# EAGLE design Equemático (EAGLE 9.6.2)
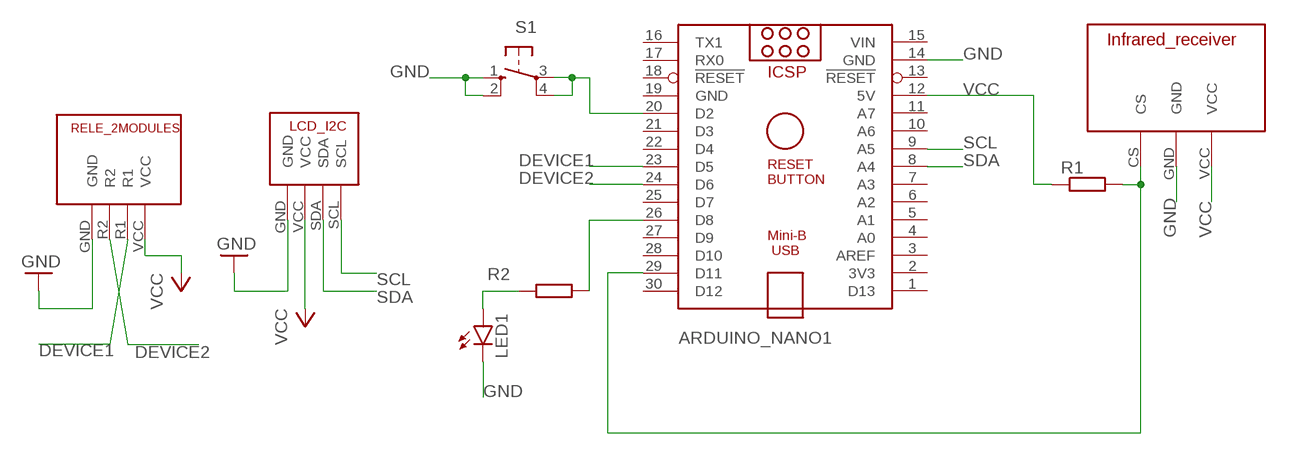
[diagram p0: schematic, sheet 1]

## Parts
ARDUINO_NANO1  ARDUINO_NANO  [ARDUINO_NANO]
LED1  LED5MM  [LED5MM]
R1  R-EU_0207/10  [0207/10]
R2  R-EU_0207/10  [0207/10]
S1  10-XX  [B3F-10XX]
U$1  INFRARED_RECEIVER  [INFRARED_RECEIVER_FOOTPRINT]
U$6  RELE_2MODULES  [RELE_2MODULES_FOOTPRINT]
U$10  LCD_I2C  [LCD_I2C_FOOTPRINT]

## Nets
DEVICE1: ARDUINO_NANO1.23(D5) U$6.R1
DEVICE2: ARDUINO_NANO1.24(D6) U$6.R2
GND: ARDUINO_NANO1.14(GND) LED1.K(C) S1.1(S) S1.2(S1) U$1.GND U$6.GND U$10.GND
N$3: ARDUINO_NANO1.26(D8) R2.2
N$4: LED1.A R2.1
N$5: ARDUINO_NANO1.29(D11) R1.2 U$1.CS
N$6: ARDUINO_NANO1.20(D2) S1.3(P) S1.4(P1)
SCL: ARDUINO_NANO1.9(A5) U$10.SCL
SDA: ARDUINO_NANO1.8(A4) U$10.SDA
VCC: ARDUINO_NANO1.12(5V) R1.1 U$1.VCC U$6.VCC U$10.VCC
Unconnected: ARDUINO_NANO1.1(D13) ARDUINO_NANO1.2(3V3) ARDUINO_NANO1.3(AREF) ARDUINO_NANO1.4(A0) ARDUINO_NANO1.5(A1) ARDUINO_NANO1.6(A2) ARDUINO_NANO1.7(A3) ARDUINO_NANO1.10(A6) ARDUINO_NANO1.11(A7) ARDUINO_NANO1.13(!RESET) ARDUINO_NANO1.16(TX1) ARDUINO_NANO1.17(RX0) ARDUINO_NANO1.18(!RESET) ARDUINO_NANO1.21(D3) ARDUINO_NANO1.22(D4) ARDUINO_NANO1.25(D7) ARDUINO_NANO1.27(D9) ARDUINO_NANO1.28(D10) ARDUINO_NANO1.30(D12)

## Power pins joined to a net without a drawn wire
GND: ARDUINO_NANO1.19(GND)
VIN: ARDUINO_NANO1.15(VIN)

## Library data of the parts
ARDUINO_NANO1 = ArduinoNanoV30:ARDUINO_NANO: Arduino Nano V3.0 Overview: The Arduino Nano is a small, complete, and breadboard-friendly board based on the ATmega328 (Arduino Nano 3.x) or ATmega168 (Arduino Nano 2.x). It has more or less the same functionality of the Arduino Duemilanove, but in a different package. It lacks only a DC power jack, and works with a Mini-B USB cable instead of a standard one. The Nano was designed and is being produced by Gravitech. Specifications: Microcontroller Atmel ATmega168 or ATmega328 Operating Voltage (logic level) 5 V Input Voltage (recommended) 7-12 V Input Voltage (limits) 6-20 V Digital I/O Pins 14 (of which 6 provide PWM output) Analog Input Pins 8 DC Current per I/O Pin 40 mA Flash Memory 16 KB (ATmega168) or 32 KB (ATmega328) of which 2 KB used by bootloader SRAM 1 KB (ATmega168) or 2 KB (ATmega328) EEPROM 512 bytes (ATmega168) or 1 KB (ATmega328) Clock Speed 16 MHz Dimensions 0.73" x 1.70" Length 45 mm Width 18 mm Weigth 5 g Power: The Arduino Nano can be powered via the Mini-B USB connection, 6-20V unregulated external power supply (pin 30), or 5V regulated external power supply (pin 27). The power source is automatically selected to the highest voltage source. Memory: The ATmega168 has 16 KB of flash memory for storing code (of which 2 KB is used for the bootloader); the ATmega328 has 32 KB, (also with 2 KB used for the bootloader). The ATmega168 has 1 KB of SRAM and 512 bytes of EEPROM (which can be read and written with the EEPROM library); the ATmega328 has 2 KB of SRAM and 1 KB of EEPROM. Input and Output: Each of the 14 digital pins on the Nano can be used as an input or output, using pinMode(), digitalWrite(), and digitalRead() functions. They operate at 5 volts. Each pin can provide or receive a maximum of 40 mA and has an internal pull-up resistor (disconnected by default) of 20-50 kOhms. In addition, some pins have specialized functions. Visit Arduino - ArduinoBoardNano <https://www.arduino.cc/en/Main/ArduinoBoardNano>
LED1 = led:LED: LED OSRAM: - CHIPLED LG R971, LG N971, LY N971, LG Q971, LY Q971, LO R971, LY R971 LH N974, LH R974 LS Q976, LO Q976, LY Q976 LO Q996 - Hyper CHIPLED LW Q18S LB Q993, LB Q99A, LB R99A - SideLED LS A670, LO A670, LY A670, LG A670, LP A670 LB A673, LV A673, LT A673, LW A673 LH A674 LY A675 LS A676, LA A676, LO A676, LY A676, LW A676 LS A679, LY A679, LG A679 - Hyper Micro SIDELED® LS Y876, LA Y876, LO Y876, LY Y876 LT Y87S - SmartLED LW L88C, LW L88S LB L89C, LB L89S, LG L890 LS L89K, LO L89K, LY L89K LS L896, LA L896, LO L896, LY L896 - TOPLED LS T670, LO T670, LY T670, LG T670, LP T670 LSG T670, LSP T670, LSY T670, LOP T670, LYG T670 LG T671, LOG T671, LSG T671 LB T673, LV T673, LT T673, LW T673 LH T674 LS T676, LA T676, LO T676, LY T676, LB T676, LH T676, LSB T676, LW T676 LB T67C, LV T67C, LT T67C, LS T67K, LO T67K, LY T67K, LW E67C LS E67B, LA E67B, LO E67B, LY E67B, LB E67C, LV E67C, LT E67C LW T67C LS T679, LY T679, LG T679 LS T770, LO T770, LY T770, LG T770, LP T770 LB T773, LV T773, LT T773, LW T773 LH T774 LS E675, LA E675, LY E675, LS T675 LS T776, LA T776, LO T776, LY T776, LB T776 LHGB T686 LT T68C, LB T68C - Hyper Mini TOPLED® LB M676 - Mini TOPLED Santana® LG M470 LS M47K, LO M47K, LY M47K Source: http://www.osram.convergy.de LUXEON: - LUMILED® LXK2-PW12-R00, LXK2-PW12-S00, LXK2-PW14-U00, LXK2-PW14-V00 LXK2-PM12-R00, LXK2-PM12-S00, LXK2-PM14-U00 LXK2-PE12-Q00, LXK2-PE12-R00, LXK2-PE12-S00, LXK2-PE14-T00, LXK2-PE14-U00 LXK2-PB12-K00, LXK2-PB12-L00, LXK2-PB12-M00, LXK2-PB14-N00, LXK2-PB14-P00, LXK2-PB14-Q00 LXK2-PR12-L00, LXK2-PR12-M00, LXK2-PR14-Q00, LXK2-PR14-R00 LXK2-PD12-Q00, LXK2-PD12-R00, LXK2-PD12-S00 LXK2-PH12-R00, LXK2-PH12-S00 LXK2-PL12-P00, LXK2-PL12-Q00, LXK2-PL12-R00 Source: www.luxeon.com KINGBRIGHT: KA-3528ASYC Source: www.kingbright.com
R1 R2 = rcl:R-EU_: RESISTOR, European symbol; SPICEPREFIX: R
S1 = switch-omron:10-XX: OMRON SWITCH; MPN: B3F-1000; OC_FARNELL: 176432; OC_NEWARK: 36M3542
U$1 = Meus componentes:INFRARED_RECEIVER
U$6 = Meus componentes:RELE_2MODULES
U$10 = Meus componentes:LCD_I2C

## Module LCD_I2C
Ports: 

### Library data of the parts

## Board
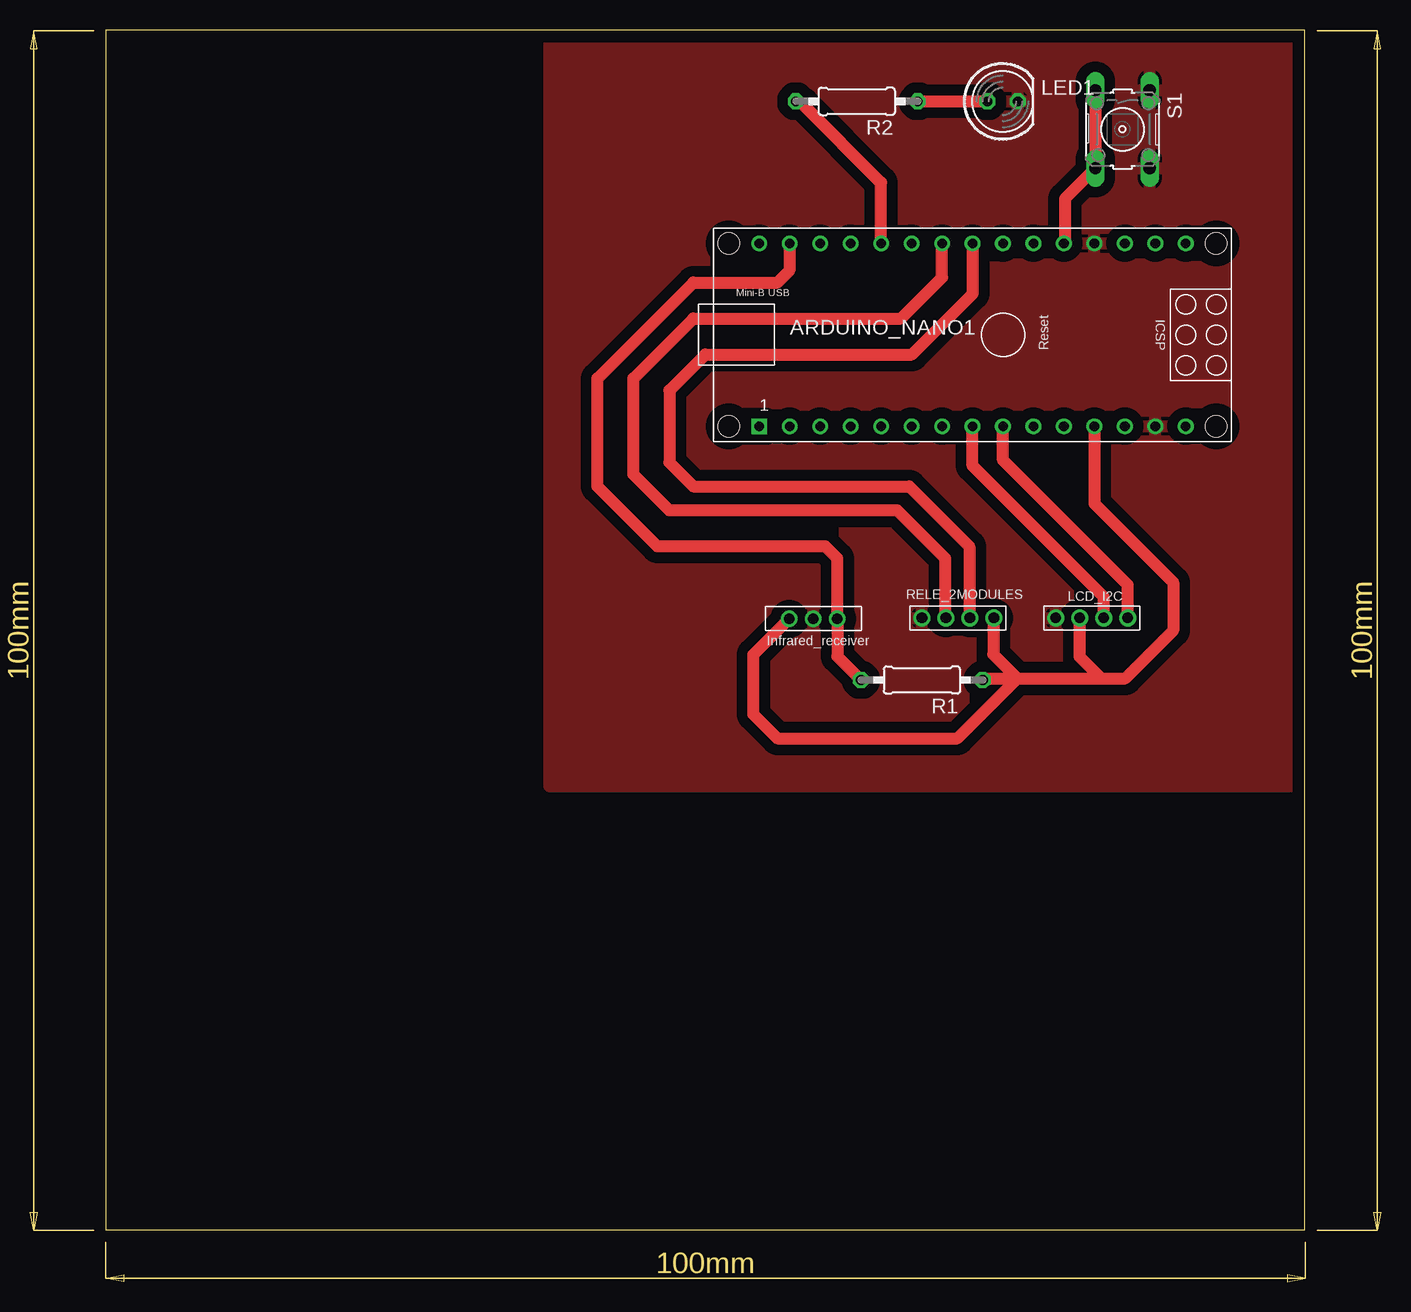
[diagram p1: board, top side]

Size 99.98 x 100.01 mm. Coordinates in mm from the lower left corner, seen from the top.
Outline: 0,0 99.98,0 99.98,100.01 0,100.01 0,0
Copper layers (1*16): Top 0.035mm / dielectric 1.5mm / Bottom 0.035mm
Design rules "default *": minimum track width 1mm, minimum drill 0.35mm, track to track 35mil, track to pad 0.5mm, pad to pad 6mil, via to via 6mil, smd to smd 6mil, copper to edge 40mil, drill to drill 6mil, minimum pad ring 10mil, minimum via ring 8mil, stop-mask expansion 4mil, vias tented up to drill 0mil, thermal gap 10mil

### Footprints (pad centres in the part's own frame; a part is rotated, then mirrored left to right if it is on the bottom)
ARDUINO_NANO = drill 0.8 square: 1 -20.32,-7.62 | drill 0.8: 2 -17.78,-7.62; 3 -15.24,-7.62; 4 -12.7,-7.62; 5 -10.16,-7.62; 6 -7.62,-7.62; 7 -5.08,-7.62; 8 -2.54,-7.62; 9 0,-7.62; 10 2.54,-7.62; 11 5.08,-7.62; 12 7.62,-7.62; 13 10.16,-7.62; 14 12.7,-7.62; 15 15.24,-7.62; 16 15.24,7.62; 17 12.7,7.62; 18 10.16,7.62; 19 7.62,7.62; 20 5.08,7.62; 21 2.54,7.62; 22 0,7.62; 23 -2.54,7.62; 24 -5.08,7.62; 25 -7.62,7.62; 26 -10.16,7.62; 27 -12.7,7.62; 28 -15.24,7.62; 29 -17.78,7.62; 30 -20.32,7.62 | hole 1.778: -22.86,-7.62; -22.86,7.62; 17.78,7.62; 17.78,-7.62
LED5MM = drill 0.813 octagon: A -1.27,0; K 1.27,0
0207/10 = drill 0.813 octagon: 1 -5.08,0; 2 5.08,0
B3F-10XX = drill 1.016 long: 1 -3.251,2.261; 2 3.251,2.261; 3 -3.251,-2.261; 4 3.251,-2.261
INFRARED_RECEIVER_FOOTPRINT = drill 0.85: CS 2,1; GND 4,1; VCC 6,1
RELE_2MODULES_FOOTPRINT = drill 0.891: GND -3,0; R1 1,0; R2 -1,0; VCC 3,0
LCD_I2C_FOOTPRINT = drill 0.891: GND -3,0; SCL 3,0; SDA 1,0; VCC -1,0

### Placement (x,y rotation side)
ARDUINO_NANO1  74.81,74.6 0 top
LED1  74.78,94.06 0 top
R1  68.05,45.82 180 top
R2  62.62,94.06 180 top
S1  84.78,91.73 270 top
U$1  63,51.93 180 top
U$6  71.05,51 0 top
U$10  82.21,51 0 top

### Tracks (layer width: path | path; a pad name or v marks a point on that pad's centre or on a via)
DEVICE1
  Top 1: U$6.R1 72,51.05 72,56.95 67,61.95 49,61.95 47,63.95 47,69.95 50,72.95 67.2,72.95 72.3,78.05 72.3,82.19 ARDUINO_NANO1.23
DEVICE2
  Top 1: U$6.R2 70,51.05 70,55.95 66,59.95 47,59.95 44,62.95 44,70.95 49,75.95 66.3,75.95 69.73,79.38 ARDUINO_NANO1.24
GND
  pour Top: 37,98.95 99,98.95 99,36.95 37,36.95
N$3
  Top 1: R2.2 58.08,93.87 64.65,87.3 ARDUINO_NANO1.26
N$4
  Top 1: R2.1 LED1.A
N$5
  Top 1: ARDUINO_NANO1.29 57,82.19 57,79.95 56,78.95 49,78.95 41,70.95 41,61.95 46,56.95 60,56.95 61,55.95 U$1.CS 61,47.79 R1.2
N$6
  Top 1: ARDUINO_NANO1.20 79.97,82.35 79.97,85.93 S1.4 S1.3
SCL
  Top 1: U$10.SCL 85.21,53.74 74.81,64.14 ARDUINO_NANO1.9
SDA
  Top 1: U$10.SDA 83.21,52.74 72.27,63.68 ARDUINO_NANO1.8
VCC
  Top 1: ARDUINO_NANO1.12 82.43,60.52 89,53.95 89,49.95 85,45.95 83,45.95 | 76,45.95 83,45.95 | 83,45.95 81.21,47.74 U$10.VCC | U$6.VCC 74,50.95 74,47.95 76,45.95 | R1.1 73.26,45.95 76,45.95 | 76,45.95 71,40.95 56,40.95 54,42.95 54,47.93 U$1.VCC